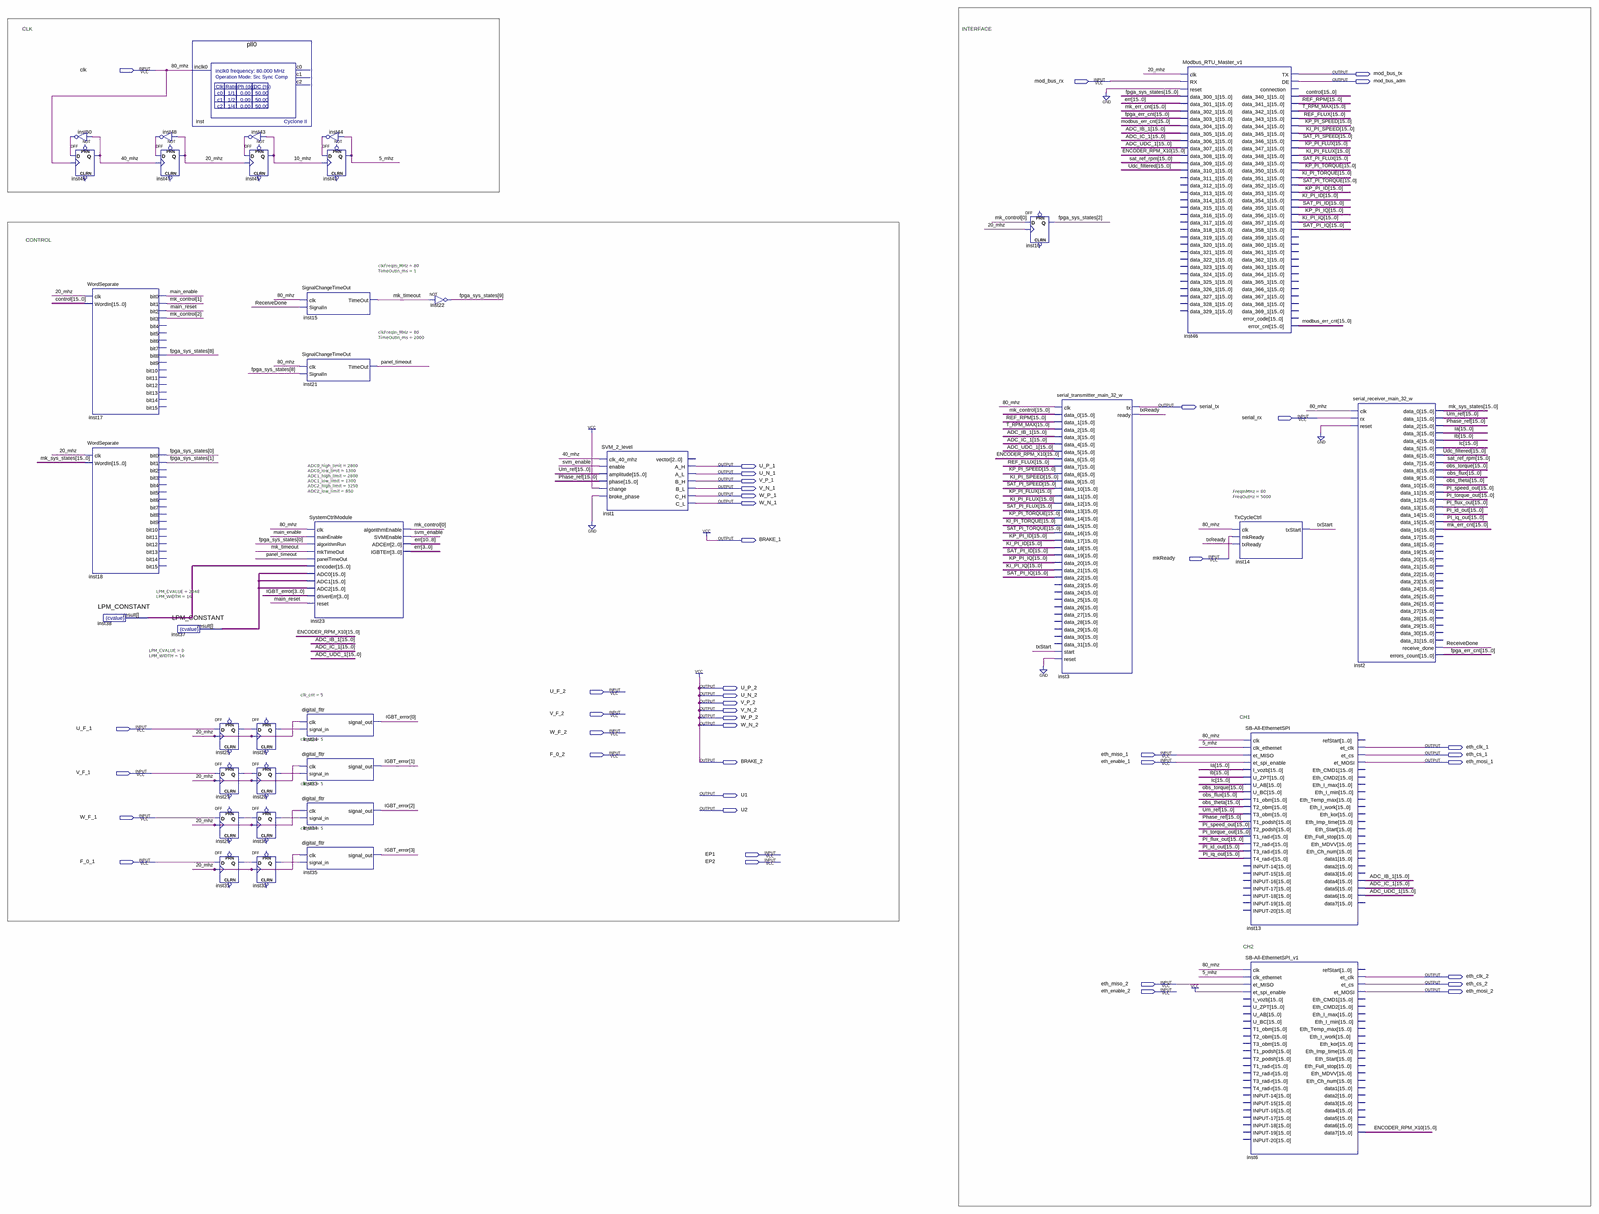
[diagram p0: schematic sheet, whole]
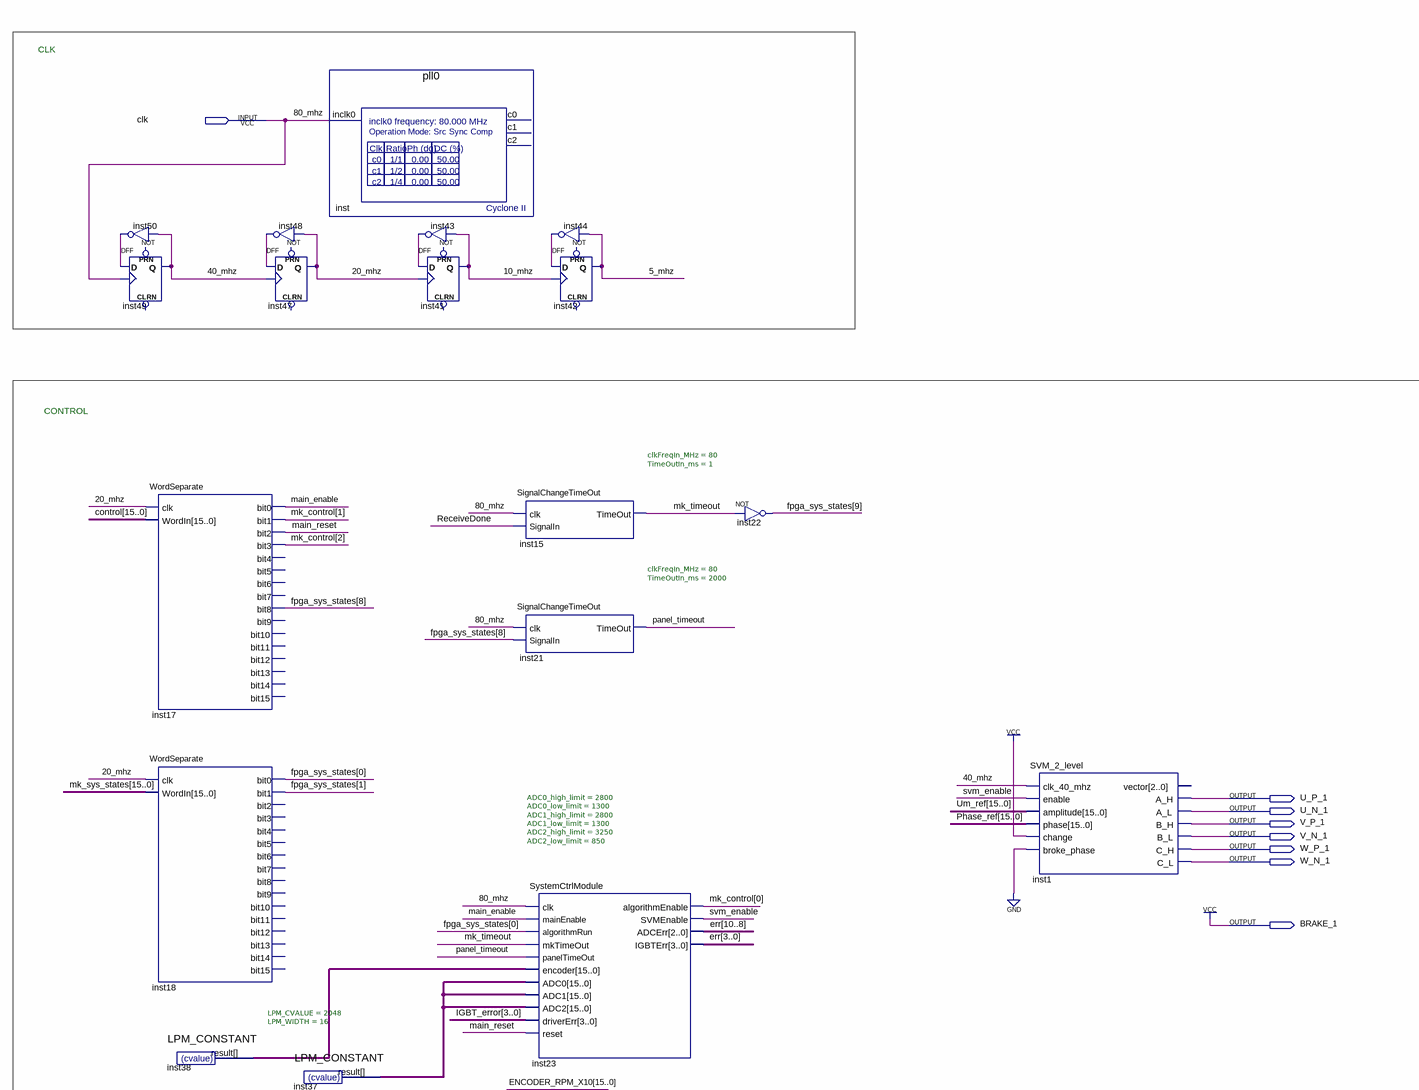
[diagram p1: schematic sheet, upper left part]
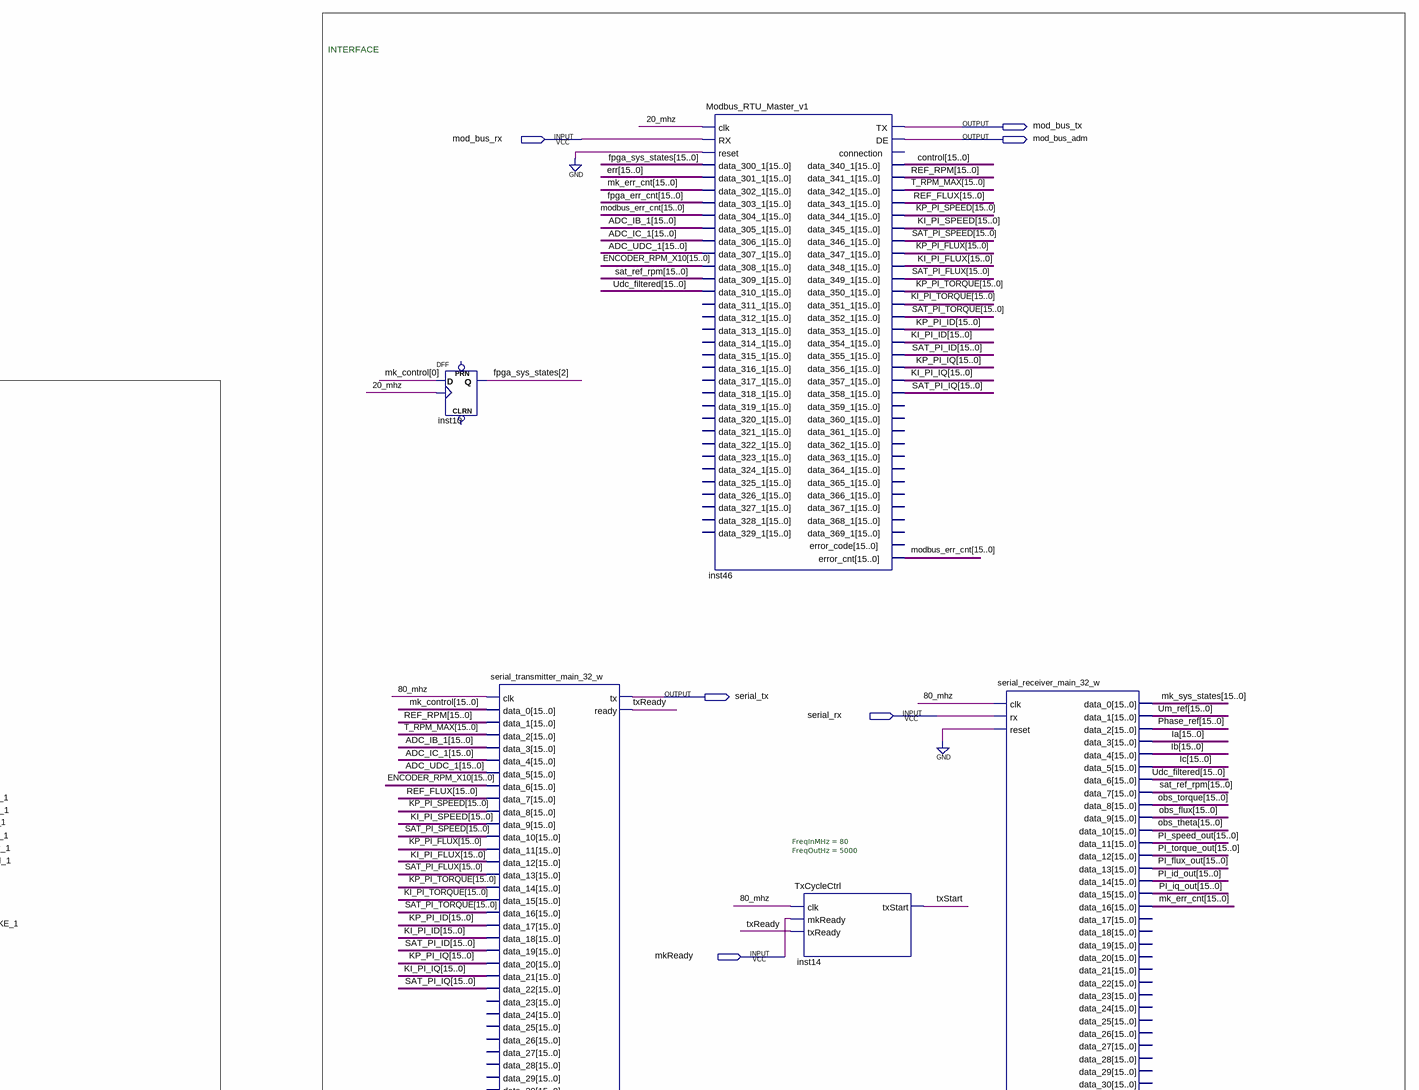
[diagram p2: schematic sheet, upper right part]
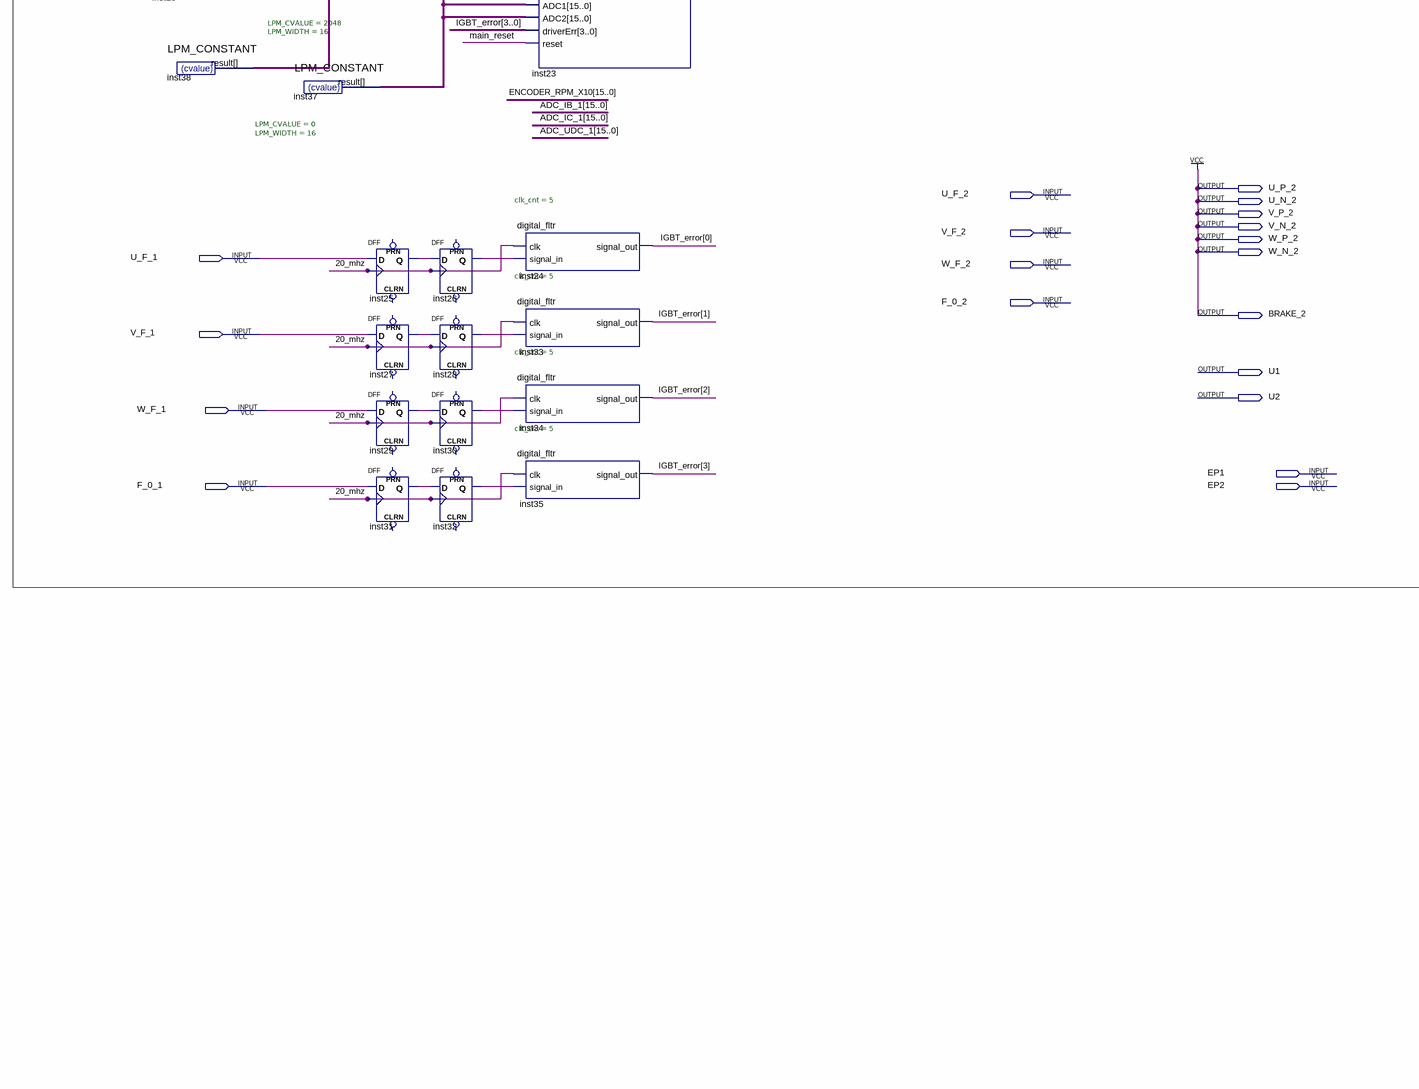
[diagram p3: schematic sheet, lower left part]
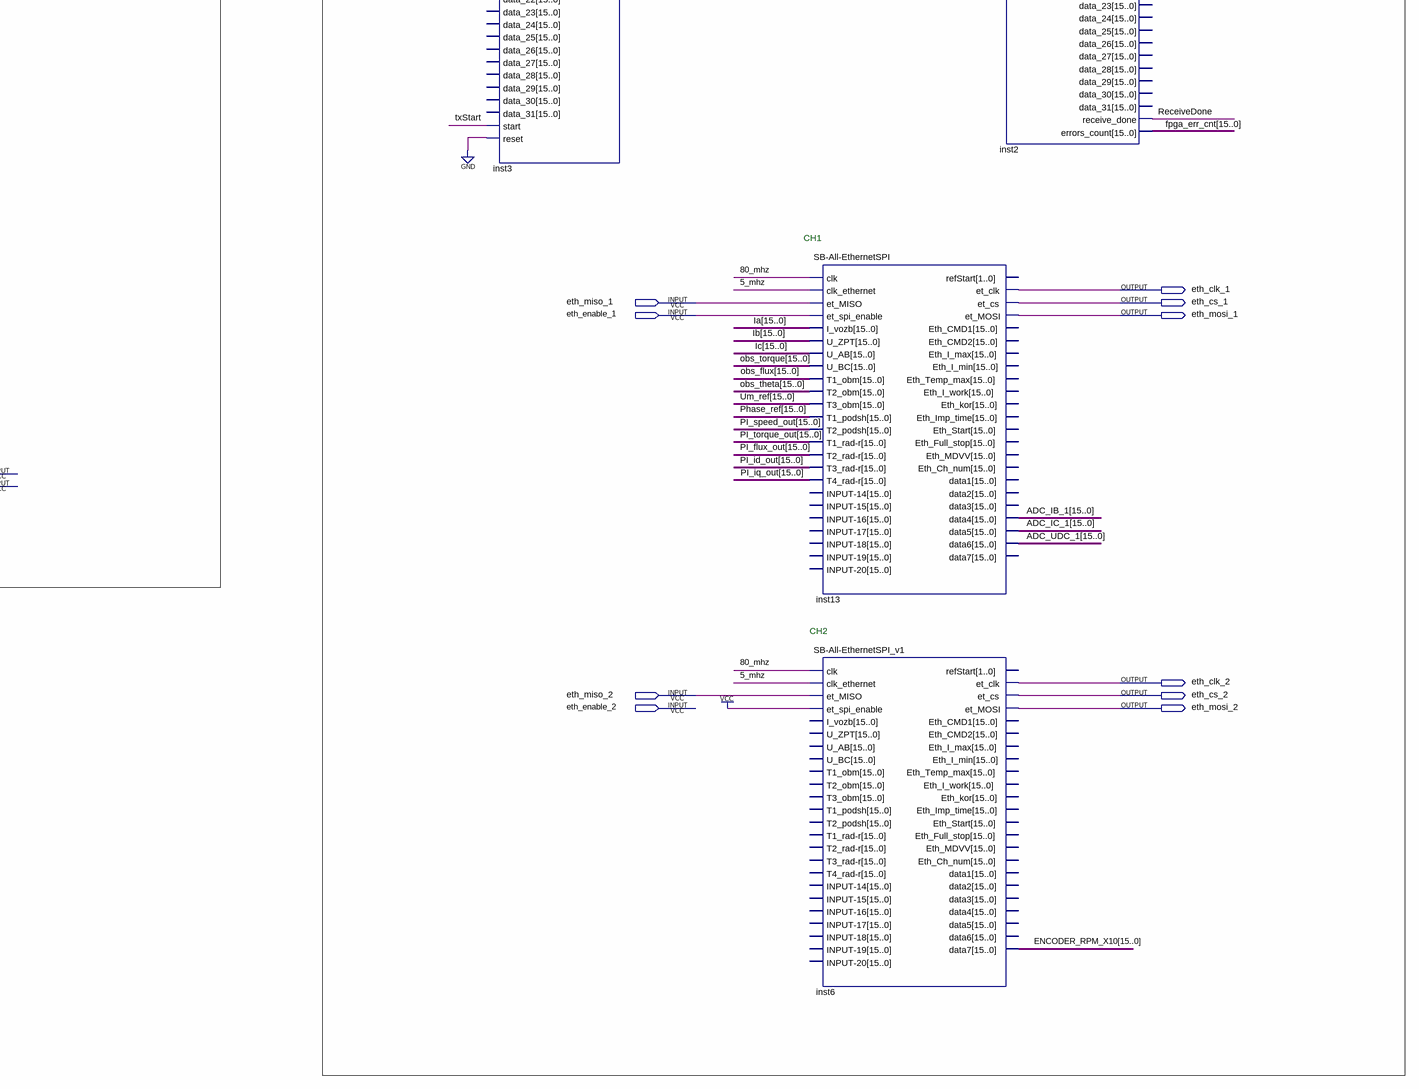
[diagram p4: schematic sheet, lower right part]
// Quartus schematic svm.bdf as structural Verilog: 37 symbols, 43 pins
module svm (
  input  clk,
  input  mod_bus_rx,
  input  serial_rx,
  input  mkReady,
  input  U_F_2,
  input  V_F_2,
  input  U_F_1,
  input  W_F_2,
  input  F_0_2,
  input  eth_miso_1,
  input  eth_enable_1,
  input  V_F_1,
  input  W_F_1,
  input  EP1,
  input  F_0_1,
  input  EP2,
  input  eth_miso_2,
  input  eth_enable_2,
  output mod_bus_tx,
  output mod_bus_adm,
  output serial_tx,
  output U_P_1,
  output U_N_1,
  output V_P_1,
  output V_N_1,
  output W_P_1,
  output W_N_1,
  output BRAKE_1,
  output U_P_2,
  output U_N_2,
  output V_P_2,
  output V_N_2,
  output W_P_2,
  output W_N_2,
  output eth_clk_1,
  output eth_cs_1,
  output BRAKE_2,
  output eth_mosi_1,
  output U1,
  output U2,
  output eth_clk_2,
  output eth_cs_2,
  output eth_mosi_2
);

  wire \5_mhz , \10_mhz , \20_mhz , \40_mhz , inst25_q, inst26_q, inst27_q, inst28_q, inst29_q, inst30_q,
       inst31_q, inst32_q, inst43_out, inst44_out, inst48_out, inst50_out, main_enable, main_reset,
       mk_timeout, panel_timeout, ReceiveDone, svm_enable, txReady, txStart;
  wire [3:0] IGBT_error;
  wire [15:0] ADC_IB_1, ADC_IC_1, ADC_UDC_1, control, ENCODER_RPM_X10, err, fpga_err_cnt, fpga_sys_states,
       Ia, Ib, Ic, inst37_result, inst38_result, KI_PI_FLUX, KI_PI_ID, KI_PI_IQ, KI_PI_SPEED, KI_PI_TORQUE,
       KP_PI_FLUX, KP_PI_ID, KP_PI_IQ, KP_PI_SPEED, KP_PI_TORQUE, mk_control, mk_err_cnt, mk_sys_states,
       modbus_err_cnt, obs_flux, obs_theta, obs_torque, Phase_ref, PI_flux_out, PI_id_out, PI_iq_out,
       PI_speed_out, PI_torque_out, REF_FLUX, REF_RPM, SAT_PI_FLUX, SAT_PI_ID, SAT_PI_IQ, SAT_PI_SPEED,
       SAT_PI_TORQUE, sat_ref_rpm, T_RPM_MAX, Udc_filtered, Um_ref;

  not inst50 (inst50_out, \40_mhz );
  DFF inst49 (.CLK(clk), .D(inst50_out), .Q(\40_mhz ));  // open: CLRN, PRN
  WordSeparate inst17 (
    .clk(\20_mhz ), .WordIn(control), .bit0(main_enable), .bit1(mk_control[1]), .bit2(main_reset),
    .bit3(mk_control[2]), .bit8(fpga_sys_states[8]));  // open: bit4, bit5, bit6, bit7, bit9, bit10, bit11, bit12, bit13, bit14, bit15
  WordSeparate inst18 (
    .clk(\20_mhz ), .WordIn(mk_sys_states), .bit0(fpga_sys_states[0]), .bit1(fpga_sys_states[1]));  // open: bit2, bit3, bit4, bit5, bit6, bit7, bit8, bit9, bit10, bit11, bit12, bit13, bit14, bit15
  LPM_CONSTANT #(.LPM_CVALUE(0), .LPM_WIDTH(16)) inst38 (.result(inst38_result));
  not inst48 (inst48_out, \20_mhz );
  DFF inst47 (.CLK(\40_mhz ), .D(inst48_out), .Q(\20_mhz ));  // open: CLRN, PRN
  pll0 inst (.inclk0(clk));  // open: c0, c1, c2
  LPM_CONSTANT #(.LPM_CVALUE(2048), .LPM_WIDTH(16)) inst37 (.result(inst37_result));
  DFF inst25 (.CLK(\20_mhz ), .D(U_F_1), .Q(inst25_q));  // open: CLRN, PRN
  DFF inst27 (.CLK(\20_mhz ), .D(V_F_1), .Q(inst27_q));  // open: CLRN, PRN
  DFF inst29 (.CLK(\20_mhz ), .D(W_F_1), .Q(inst29_q));  // open: CLRN, PRN
  DFF inst31 (.CLK(\20_mhz ), .D(F_0_1), .Q(inst31_q));  // open: CLRN, PRN
  not inst43 (inst43_out, \10_mhz );
  DFF inst41 (.CLK(\20_mhz ), .D(inst43_out), .Q(\10_mhz ));  // open: CLRN, PRN
  DFF inst26 (.CLK(\20_mhz ), .D(inst25_q), .Q(inst26_q));  // open: CLRN, PRN
  DFF inst28 (.CLK(\20_mhz ), .D(inst27_q), .Q(inst28_q));  // open: CLRN, PRN
  DFF inst30 (.CLK(\20_mhz ), .D(inst29_q), .Q(inst30_q));  // open: CLRN, PRN
  DFF inst32 (.CLK(\20_mhz ), .D(inst31_q), .Q(inst32_q));  // open: CLRN, PRN
  SignalChangeTimeOut #(.clkFreqIn_MHz(80), .TimeOutIn_ms(1)) inst15 (
    .clk(clk), .SignalIn(ReceiveDone), .TimeOut(mk_timeout));
  SignalChangeTimeOut #(.clkFreqIn_MHz(80), .TimeOutIn_ms(2000)) inst21 (
    .clk(clk), .SignalIn(fpga_sys_states[8]), .TimeOut(panel_timeout));
  SystemCtrlModule #(.ADC0_high_limit(2800), .ADC0_low_limit(1300), .ADC1_high_limit(2800), .ADC1_low_limit(1300), .ADC2_high_limit(3250), .ADC2_low_limit(850)) inst23 (
    .clk(clk), .mainEnable(main_enable), .algorithmRun(fpga_sys_states[0]), .mkTimeOut(mk_timeout),
    .panelTimeOut(panel_timeout), .encoder(inst38_result), .ADC0(inst37_result), .ADC1(inst37_result),
    .ADC2(inst37_result), .driverErr(IGBT_error), .reset(main_reset), .algorithmEnable(mk_control[0]),
    .SVMEnable(svm_enable), .ADCErr(err[10:8]), .IGBTErr(err[3:0]));
  digital_fltr #(.clk_cnt(5)) inst24 (.clk(\20_mhz ), .signal_in(inst26_q), .signal_out(IGBT_error[0]));
  digital_fltr #(.clk_cnt(5)) inst33 (.clk(\20_mhz ), .signal_in(inst28_q), .signal_out(IGBT_error[1]));
  digital_fltr #(.clk_cnt(5)) inst34 (.clk(\20_mhz ), .signal_in(inst30_q), .signal_out(IGBT_error[2]));
  digital_fltr #(.clk_cnt(5)) inst35 (.clk(\20_mhz ), .signal_in(inst32_q), .signal_out(IGBT_error[3]));
  not inst44 (inst44_out, \5_mhz );
  DFF inst42 (.CLK(\10_mhz ), .D(inst44_out), .Q(\5_mhz ));  // open: CLRN, PRN
  not inst22 (fpga_sys_states[9], mk_timeout);
  SVM_2_level inst1 (
    .clk_40_mhz(\40_mhz ), .enable(svm_enable), .amplitude(Um_ref), .phase(Phase_ref), .change(1'b1),
    .broke_phase(1'b0), .A_H(U_P_1), .A_L(U_N_1), .B_H(V_P_1), .B_L(V_N_1), .C_H(W_P_1), .C_L(W_N_1));  // open: vector
  DFF inst10 (.CLK(\20_mhz ), .D(mk_control[0]), .Q(fpga_sys_states[2]));  // open: CLRN, PRN
  serial_transmitter_main_32_w inst3 (
    .clk(clk), .data_0(mk_control), .data_1(REF_RPM), .data_2(T_RPM_MAX), .data_3(ADC_IB_1),
    .data_4(ADC_IC_1), .data_5(ADC_UDC_1), .data_6(ENCODER_RPM_X10), .data_7(REF_FLUX), .data_8(KP_PI_SPEED),
    .data_9(KI_PI_SPEED), .data_10(SAT_PI_SPEED), .data_11(KP_PI_FLUX), .data_12(KI_PI_FLUX),
    .data_13(SAT_PI_FLUX), .data_14(KP_PI_TORQUE), .data_15(KI_PI_TORQUE), .data_16(SAT_PI_TORQUE),
    .data_17(KP_PI_ID), .data_18(KI_PI_ID), .data_19(SAT_PI_ID), .data_20(KP_PI_IQ), .data_21(KI_PI_IQ),
    .data_22(SAT_PI_IQ), .start(txStart), .reset(1'b0), .tx(serial_tx), .ready(txReady));  // open: data_23, data_24, data_25, data_26, data_27, data_28, data_29, data_30, data_31
  Modbus_RTU_Master_v1 inst46 (
    .clk(\20_mhz ), .RX(mod_bus_rx), .reset(1'b0), .data_300_1(fpga_sys_states), .data_301_1(err),
    .data_302_1(mk_err_cnt), .data_303_1(fpga_err_cnt), .data_304_1(modbus_err_cnt), .data_305_1(ADC_IB_1),
    .data_306_1(ADC_IC_1), .data_307_1(ADC_UDC_1), .data_308_1(ENCODER_RPM_X10), .data_309_1(sat_ref_rpm),
    .data_310_1(Udc_filtered), .TX(mod_bus_tx), .DE(mod_bus_adm), .data_340_1(control), .data_341_1(REF_RPM),
    .data_342_1(T_RPM_MAX), .data_343_1(REF_FLUX), .data_344_1(KP_PI_SPEED), .data_345_1(KI_PI_SPEED),
    .data_346_1(SAT_PI_SPEED), .data_347_1(KP_PI_FLUX), .data_348_1(KI_PI_FLUX), .data_349_1(SAT_PI_FLUX),
    .data_350_1(KP_PI_TORQUE), .data_351_1(KI_PI_TORQUE), .data_352_1(SAT_PI_TORQUE), .data_353_1(KP_PI_ID),
    .data_354_1(KI_PI_ID), .data_355_1(SAT_PI_ID), .data_356_1(KP_PI_IQ), .data_357_1(KI_PI_IQ),
    .data_358_1(SAT_PI_IQ), .error_cnt(modbus_err_cnt));  // open: data_311_1, data_312_1, data_313_1, data_314_1, data_315_1, data_316_1, data_317_1, data_318_1, data_319_1, data_320_1, data_321_1, data_322_1, data_323_1, data_324_1, data_325_1, data_326_1, data_327_1, data_328_1, data_329_1, connection, data_359_1, data_360_1, data_361_1, data_362_1, data_363_1, data_364_1, data_365_1, data_366_1, data_367_1, data_368_1, data_369_1, error_code
  TxCycleCtrl #(.FreqInMHz(80), .FreqOutHz(5000)) inst14 (
    .clk(clk), .mkReady(mkReady), .txReady(txReady), .txStart(txStart));
  \SB-All-EthernetSPI  inst13 (
    .clk(clk), .clk_ethernet(\5_mhz ), .et_MISO(eth_miso_1), .et_spi_enable(eth_enable_1), .I_vozb(Ia),
    .U_ZPT(Ib), .U_AB(Ic), .U_BC(obs_torque), .T1_obm(obs_flux), .T2_obm(obs_theta), .T3_obm(Um_ref),
    .T1_podsh(Phase_ref), .T2_podsh(PI_speed_out), .\T1_rad-r (PI_torque_out), .\T2_rad-r (PI_flux_out),
    .\T3_rad-r (PI_id_out), .\T4_rad-r (PI_iq_out), .et_clk(eth_clk_1), .et_cs(eth_cs_1),
    .et_MOSI(eth_mosi_1), .data4(ADC_IB_1), .data5(ADC_IC_1), .data6(ADC_UDC_1));  // open: INPUT-14, INPUT-15, INPUT-16, INPUT-17, INPUT-18, INPUT-19, INPUT-20, refStart, Eth_CMD1, Eth_CMD2, Eth_I_max, Eth_I_min, Eth_Temp_max, Eth_I_work, Eth_kor, Eth_Imp_time, Eth_Start, Eth_Full_stop, Eth_MDVV, Eth_Ch_num, data1, data2, data3, data7
  \SB-All-EthernetSPI_v1  inst6 (
    .clk(clk), .clk_ethernet(\5_mhz ), .et_MISO(eth_miso_2), .et_spi_enable(1'b1), .et_clk(eth_clk_2),
    .et_cs(eth_cs_2), .et_MOSI(eth_mosi_2), .data7(ENCODER_RPM_X10));  // open: I_vozb, U_ZPT, U_AB, U_BC, T1_obm, T2_obm, T3_obm, T1_podsh, T2_podsh, T1_rad-r, T2_rad-r, T3_rad-r, T4_rad-r, INPUT-14, INPUT-15, INPUT-16, INPUT-17, INPUT-18, INPUT-19, INPUT-20, refStart, Eth_CMD1, Eth_CMD2, Eth_I_max, Eth_I_min, Eth_Temp_max, Eth_I_work, Eth_kor, Eth_Imp_time, Eth_Start, Eth_Full_stop, Eth_MDVV, Eth_Ch_num, data1, data2, data3, data4, data5, data6
  serial_receiver_main_32_w inst2 (
    .clk(clk), .rx(serial_rx), .reset(1'b0), .data_0(mk_sys_states), .data_1(Um_ref), .data_2(Phase_ref),
    .data_3(Ia), .data_4(Ib), .data_5(Ic), .data_6(Udc_filtered), .data_7(sat_ref_rpm), .data_8(obs_torque),
    .data_9(obs_flux), .data_10(obs_theta), .data_11(PI_speed_out), .data_12(PI_torque_out),
    .data_13(PI_flux_out), .data_14(PI_id_out), .data_15(PI_iq_out), .data_16(mk_err_cnt),
    .receive_done(ReceiveDone), .errors_count(fpga_err_cnt));  // open: data_17, data_18, data_19, data_20, data_21, data_22, data_23, data_24, data_25, data_26, data_27, data_28, data_29, data_30, data_31

  assign BRAKE_1 = 1'b1;
  assign BRAKE_2 = 1'b1;
  assign U_N_2 = 1'b1;
  assign U_P_2 = 1'b1;
  assign V_N_2 = 1'b1;
  assign V_P_2 = 1'b1;
  assign W_N_2 = 1'b1;
  assign W_P_2 = 1'b1;

  // Other names for the same wires on the sheet: 80_mhz = clk

  // Notes on the sheet:
  //   CLK
  //   INTERFACE
  //   CONTROL
  //   CH1
  //   CH2
endmodule
